# EAGLE design SVL-Light-It-Base (EAGLE 7.7.0)
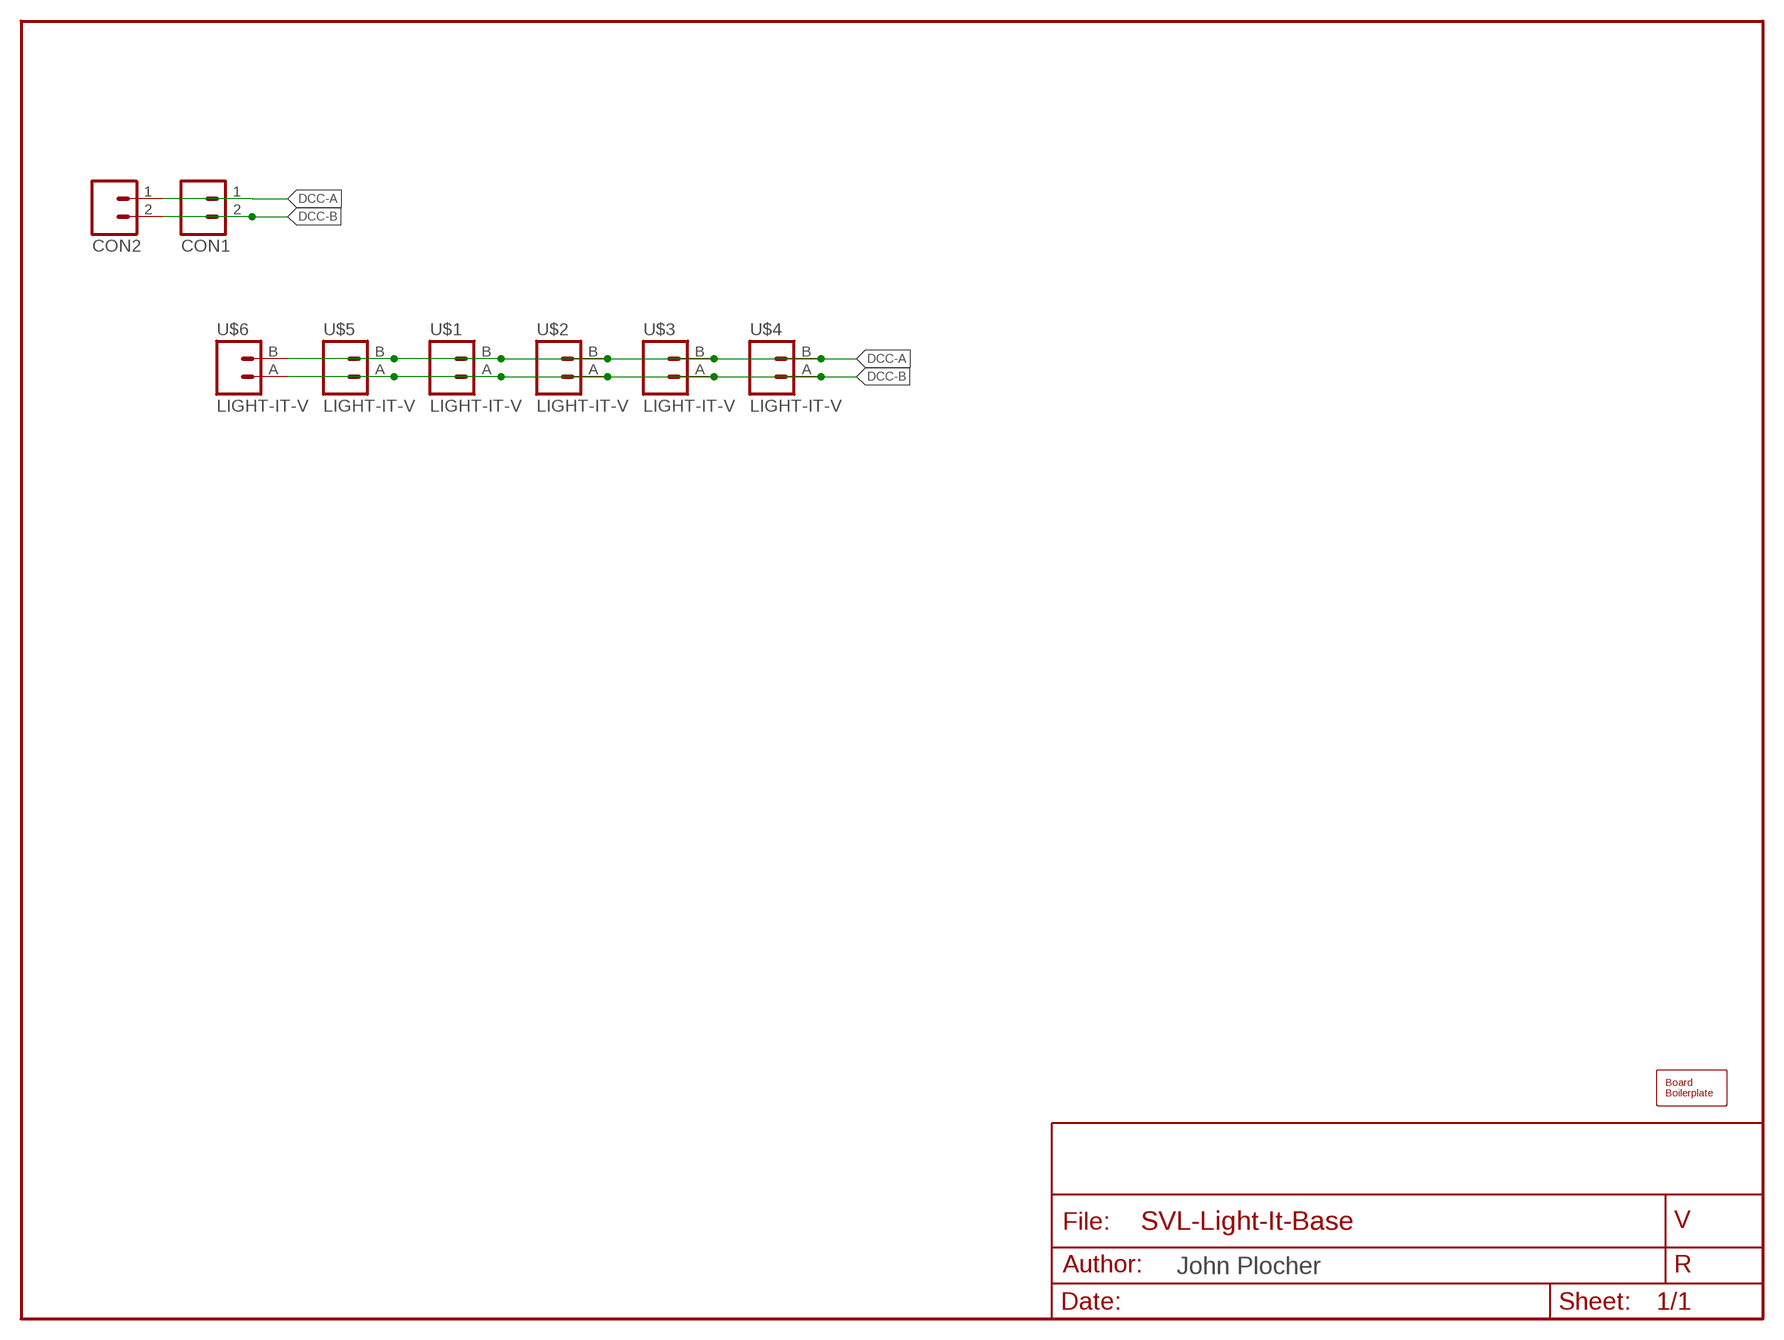
[diagram p0: schematic, sheet 1]

## Parts
BOARD1  BOARD100X100  [BOARD-SEEED10X10]
CON1  CONNECTOR-M02508-LOCK  [MSTB2]
CON2  CONNECTOR-M02508-LOCK  [MSTB2]
U$1  LIGHT-IT-V  [LIGHT-IT-V]
U$2  LIGHT-IT-V  [LIGHT-IT-V]
U$3  LIGHT-IT-V  [LIGHT-IT-V]
U$4  LIGHT-IT-V  [LIGHT-IT-V]
U$5  LIGHT-IT-V  [LIGHT-IT-V]
U$6  LIGHT-IT-V  [LIGHT-IT-V]

## Nets
DCC-A: CON1.1(A) CON2.1(A) U$1.B U$2.B U$3.B U$4.B U$5.B U$6.B
DCC-B: CON1.2(B) CON2.2(B) U$1.A U$2.A U$3.A U$4.A U$5.A U$6.A

## Library data of the parts
BOARD1 = SPCoast:BOARD
CON1 CON2 = SPCoast:CONNECTOR-M02: PHOENIX CONNECTOR
U$1-U$6 = SPCoast:LIGHT-IT-V

## Board
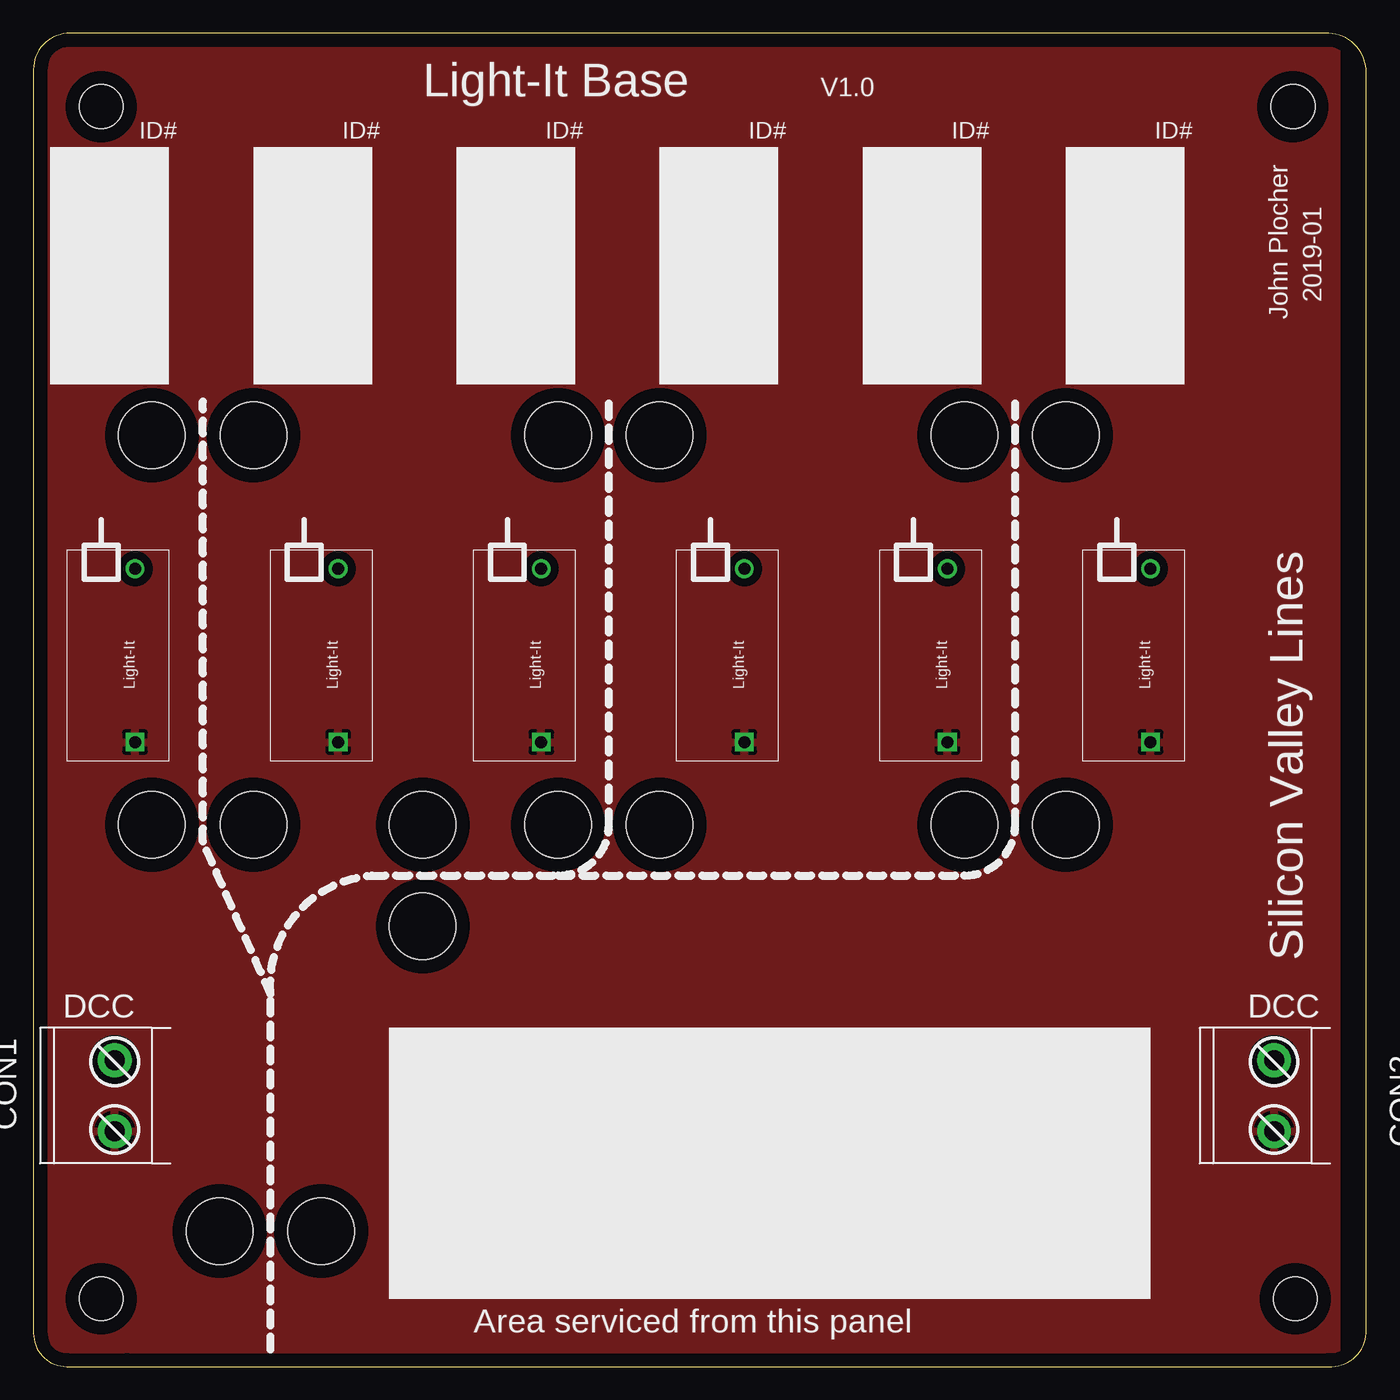
[diagram p1: board, top side]
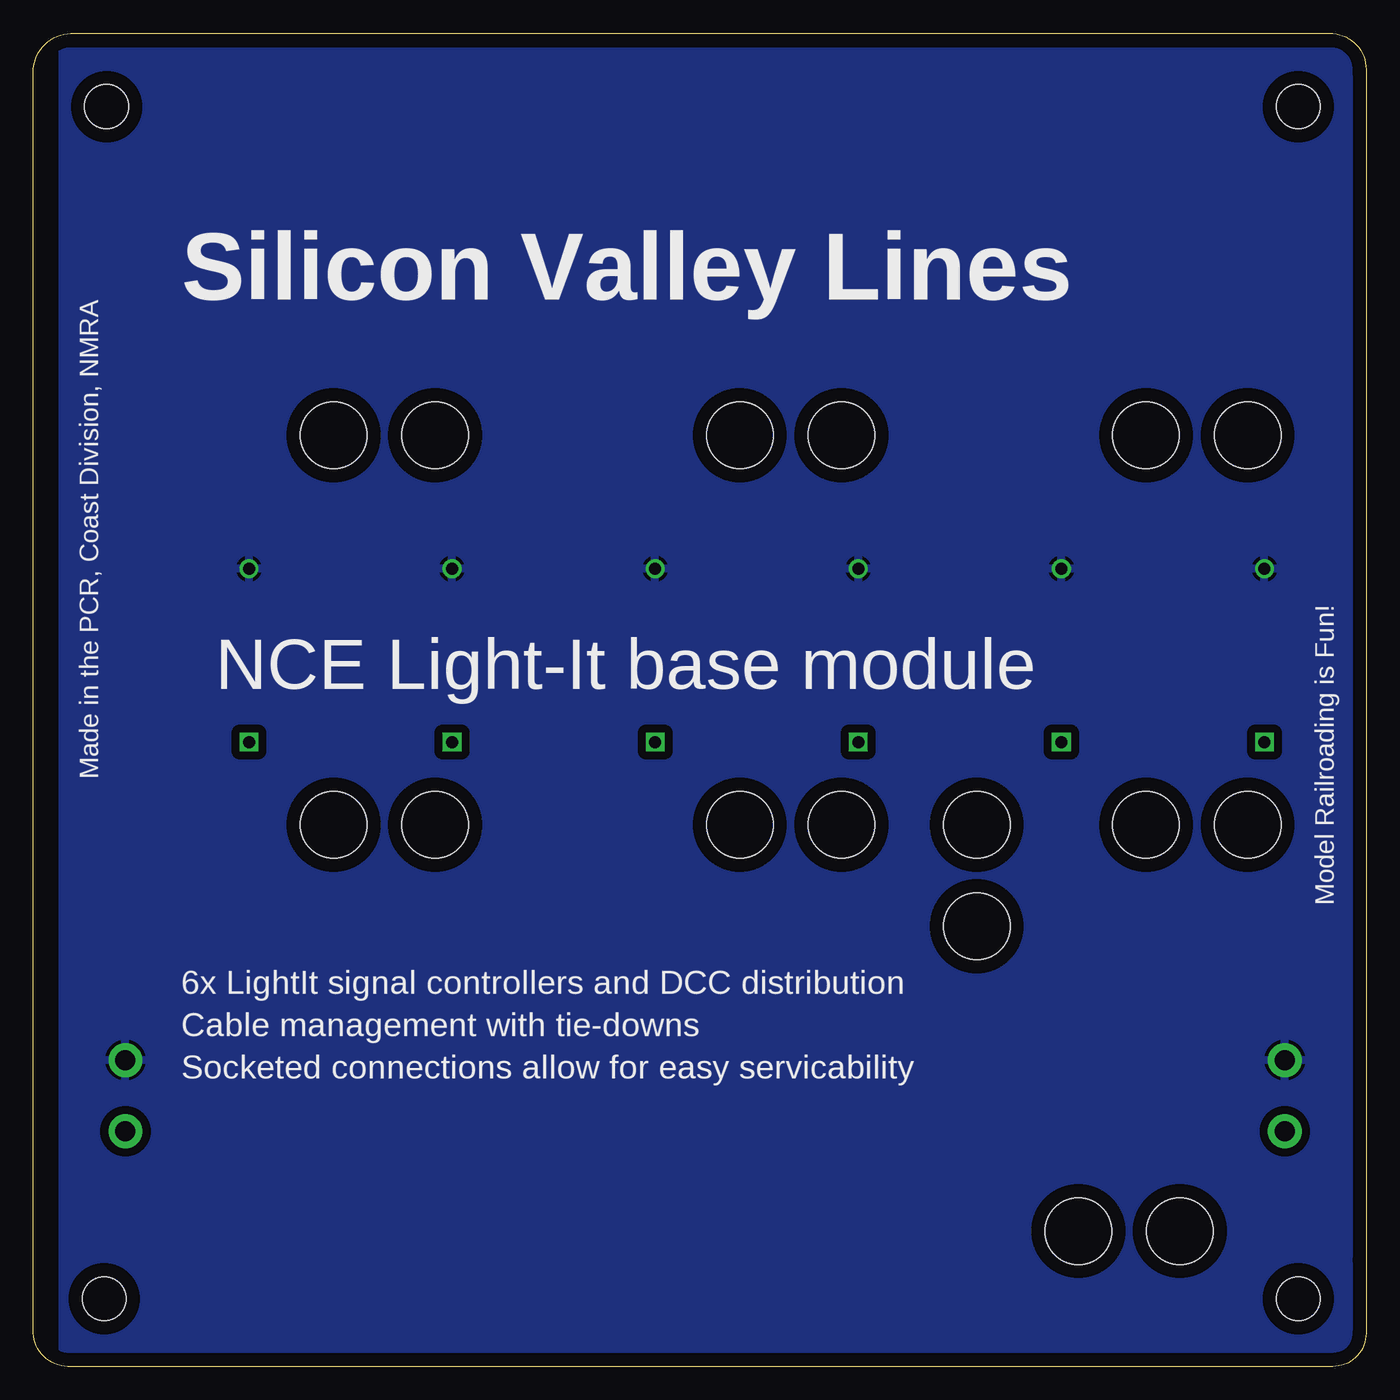
[diagram p2: board, bottom side, seen from below]

Size 100.01 x 100 mm. Coordinates in mm from the lower left corner, seen from the top.
Copper layers (1*16): Top 0.035mm / dielectric 1.5mm / Bottom 0.035mm
Design rules "default": minimum track width 10mil, minimum drill 0.6mm, track to track 8mil, track to pad 8mil, pad to pad 8mil, via to via 8mil, smd to smd 8mil, copper to edge 40mil, drill to drill 8mil, minimum pad ring 10mil, minimum via ring 8mil, stop-mask expansion 4mil, vias tented up to drill 0mil, thermal gap 10mil
Holes 5 mm at 8.9,69.85 16.52,69.85 39.38,69.85 69.86,69.85 47,69.85 77.48,69.85 8.9,40.64 16.52,40.64 39.38,40.64 47,40.64 69.86,40.64 77.48,40.64 29.22,40.64 29.22,33.02 13.98,10.16 21.6,10.16

### Footprints (pad centres in the part's own frame; a part is rotated, then mirrored left to right if it is on the bottom)
BOARD-SEEED10X10 = hole 3.3: 94.676,5.08; 5.08,94.5; 94.5,94.5; 5.08,5.08
MSTB2 = drill 1.5 pad 2.54: 1 -2.667,1.016; 2 2.667,1.016
LIGHT-IT-V = drill 0.9 square: A -6.5,0 | drill 0.9: B 6.5,0

### Placement (x,y rotation side)
BOARD1  0.01,0 0 top
CON1  5.09,20.32 270 top
CON2  92.08,20.32 270 top
U$1  7.63,53.34 90 top
U$2  22.87,53.34 90 top
U$3  38.11,53.34 90 top
U$4  53.35,53.34 90 top
U$5  68.59,53.34 90 top
U$6  83.83,53.34 90 top

### Tracks (layer width: path | path; a pad name or v marks a point on that pad's centre or on a via)
DCC-A
  pour Bottom (isolate 0.61): 1.28,99.06 1.28,1.27 97.8,1.27 97.8,99.06
DCC-B
  pour Top (isolate 0.61): 1.28,99.06 1.28,1.27 97.8,1.27 97.8,99.06

### Text on the board
tPlace: Light-It Base | V1.0 | ID# | ID# | ID# | ID# | ID# | ID# | John Plocher | 2019-01 | Silicon Valley Lines | DCC | DCC | Area serviced from this panel
bPlace: Silicon Valley Lines | Made in the PCR, Coast Division, NMRA | Model Railroading is Fun! | NCE Light-It base module | 6x LightIt signal controllers and DCC distribution | Cable management with tie-downs | Socketed connections allow for easy servicability